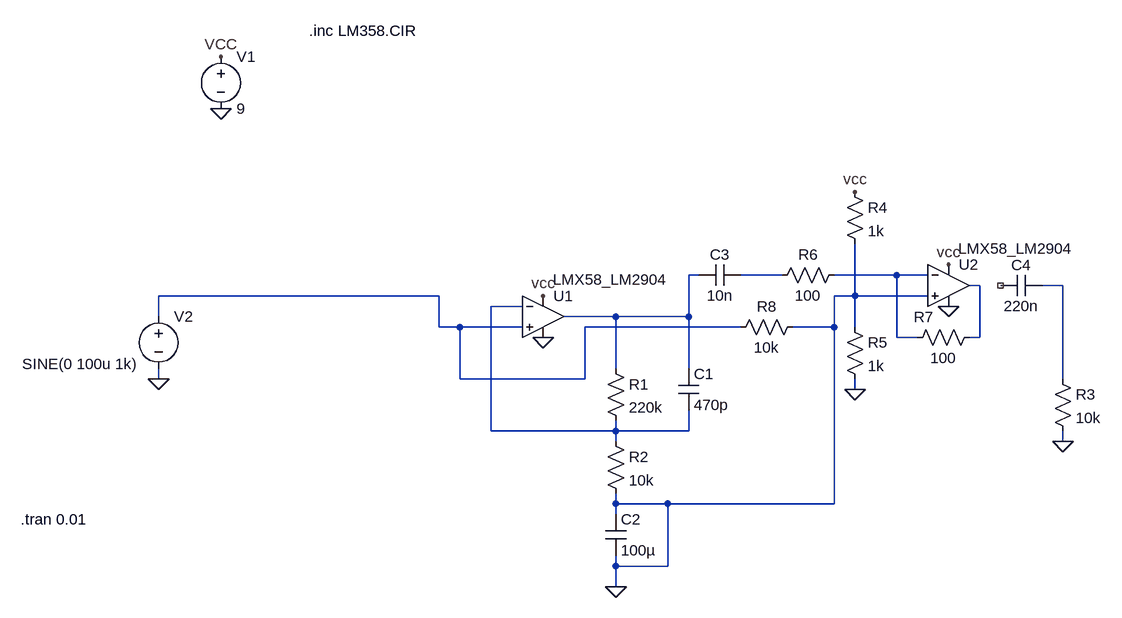
[diagram p0: schematic Draft2.asc]
Draft2.asc, the LTspice schematic file:
Version 4
SHEET 1 1268 772
WIRE 640 272 624 272
WIRE 768 272 704 272
WIRE 944 272 848 272
WIRE 992 272 944 272
WIRE 1072 288 1056 288
WIRE 1200 288 1168 288
WIRE 240 304 -192 304
WIRE 880 304 880 224
WIRE 880 304 848 304
WIRE 992 304 880 304
WIRE 368 320 320 320
WIRE -192 336 -192 304
WIRE 512 336 432 336
WIRE 624 336 624 272
WIRE 624 336 512 336
WIRE 240 352 240 304
WIRE 272 352 240 352
WIRE 368 352 272 352
WIRE 704 352 464 352
WIRE 848 352 848 304
WIRE 848 352 784 352
WIRE 880 352 880 304
WIRE 944 368 944 272
WIRE 976 368 944 368
WIRE 1072 368 1072 288
WIRE 1072 368 1056 368
WIRE 512 416 512 336
WIRE 624 416 624 336
WIRE -192 432 -192 416
WIRE 272 432 272 352
WIRE 464 432 464 352
WIRE 464 432 272 432
WIRE 1200 432 1200 288
WIRE 880 448 880 432
WIRE 320 512 320 320
WIRE 512 512 512 496
WIRE 512 512 320 512
WIRE 624 512 624 480
WIRE 624 512 512 512
WIRE 512 528 512 512
WIRE 1200 528 1200 512
WIRE 512 624 512 608
WIRE 592 624 512 624
WIRE 848 624 848 352
WIRE 848 624 592 624
WIRE 512 640 512 624
WIRE 512 720 512 704
WIRE 592 720 592 624
WIRE 592 720 512 720
WIRE 512 752 512 720
FLAG -96 -64 VCC
FLAG -96 16 0
FLAG 400 304 vcc
FLAG 400 368 0
FLAG 512 752 0
FLAG -192 432 0
FLAG 1024 320 0
FLAG 1024 256 vcc
FLAG 880 144 vcc
FLAG 880 448 0
FLAG 1200 528 0
SYMBOL voltage -96 -80 R0
WINDOW 123 0 0 Left 0
WINDOW 39 0 0 Left 0
SYMATTR InstName V1
SYMATTR Value 9
SYMBOL OpAmps\\opamp2 400 272 R0
WINDOW 3 15 7 Left 2
SYMATTR InstName U1
SYMATTR Value LMX58_LM2904
SYMBOL voltage -192 320 R0
WINDOW 3 -210 89 Left 2
WINDOW 123 0 0 Left 0
WINDOW 39 0 0 Left 0
SYMATTR InstName V2
SYMATTR Value SINE(0 100u 1k)
SYMBOL res 496 400 R0
SYMATTR InstName R1
SYMATTR Value 220k
SYMBOL res 496 512 R0
SYMATTR InstName R2
SYMATTR Value 10k
SYMBOL cap 608 416 R0
SYMATTR InstName C1
SYMATTR Value 470p
SYMBOL cap 496 640 R0
SYMATTR InstName C2
SYMATTR Value 100µ
SYMBOL OpAmps\\opamp2 1024 224 R0
WINDOW 3 15 7 Left 2
SYMATTR InstName U2
SYMATTR Value LMX58_LM2904
SYMBOL res 864 128 R0
SYMATTR InstName R4
SYMATTR Value 1k
SYMBOL res 864 336 R0
SYMATTR InstName R5
SYMATTR Value 1k
SYMBOL res 864 256 R90
WINDOW 0 0 56 VBottom 2
WINDOW 3 32 56 VTop 2
SYMATTR InstName R6
SYMATTR Value 100
SYMBOL res 1072 352 R90
WINDOW 0 0 86 VBottom 2
WINDOW 3 32 56 VTop 2
SYMATTR InstName R7
SYMATTR Value 100
SYMBOL cap 704 256 R90
WINDOW 0 0 32 VBottom 2
WINDOW 3 32 32 VTop 2
SYMATTR InstName C3
SYMATTR Value 10n
SYMBOL res 800 336 R90
WINDOW 0 0 56 VBottom 2
WINDOW 3 32 56 VTop 2
SYMATTR InstName R8
SYMATTR Value 10k
SYMBOL cap 1168 272 R90
WINDOW 0 0 32 VBottom 2
WINDOW 3 32 32 VTop 2
SYMATTR InstName C4
SYMATTR Value 220n
SYMBOL res 1184 416 R0
SYMATTR InstName R3
SYMATTR Value 10k
TEXT 40 -104 Left 2 !.inc LM358.CIR
TEXT -404 648 Left 2 !.tran 0.01

The netlist it stands for:
* Draft2.asc
V1 VCC 0 9
XU1 N006 N007 VCC 0 N001 LMX58_LM2904  ; pins In+ In- V+ V- OUT
V2 N006 0 SINE(0 100u 1k)
R1 N001 N007 220k
R2 N007 0 10k
C1 N001 N007 470p
C2 0 0 100µ
XU2 0 N003 VCC 0 N004 LMX58_LM2904  ; pins In+ In- V+ V- OUT
R4 VCC 0 1k
R5 0 0 1k
R6 N003 N002 100
R7 N004 N003 100
C3 N002 N001 10n
R8 0 N006 10k
C4 N005 NC_01 220n
R3 N005 0 10k
.inc LM358.CIR
.tran 0.01
.backanno
.end